# EAGLE design Grove - Temperature&Humidity Sensor(HDC1000) v1.0 (EAGLE 6.4)
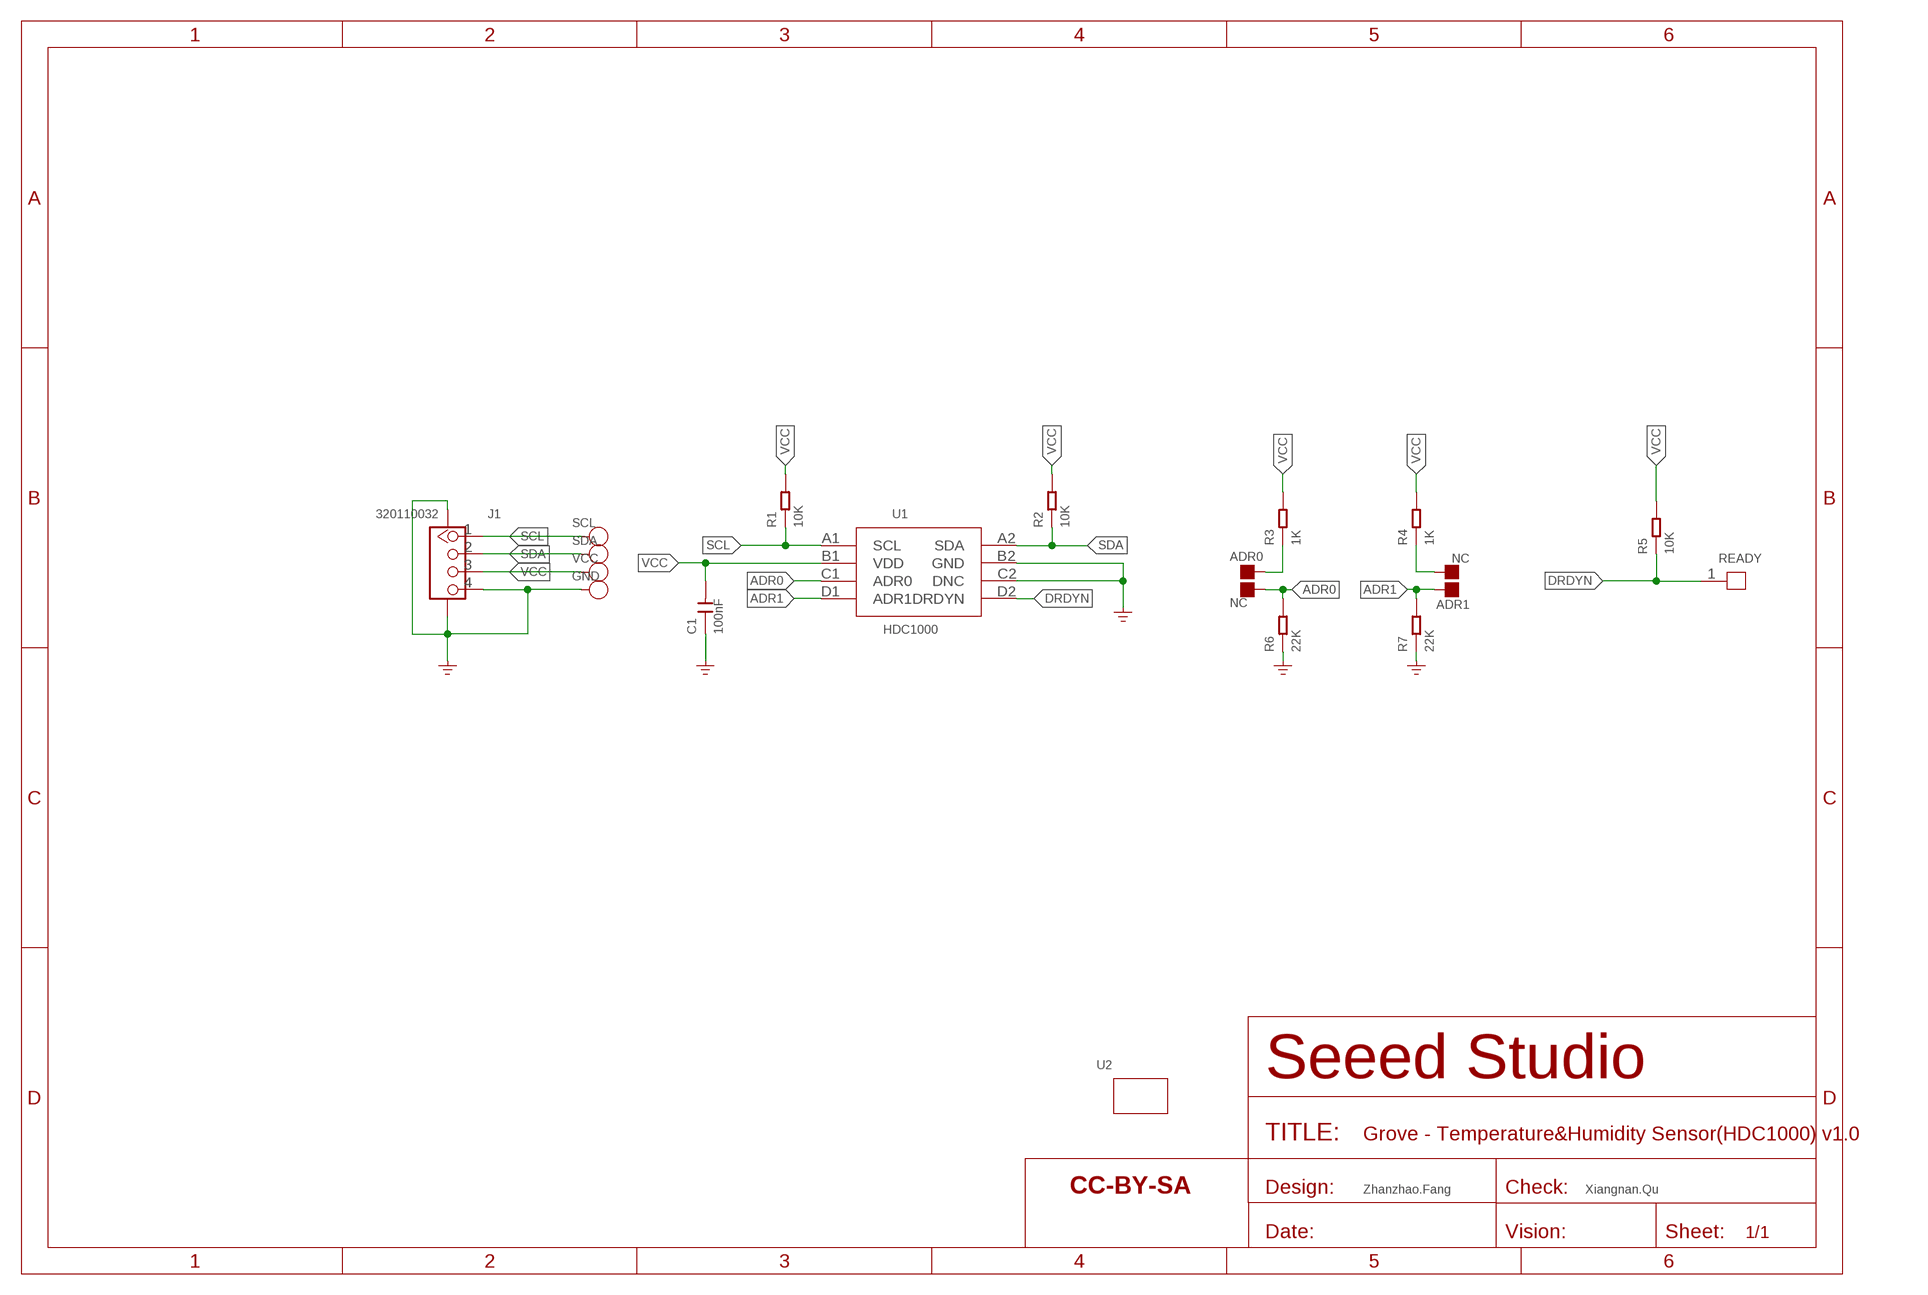
[diagram p0: schematic, sheet 1]

## Parts
ADR0  NC  JUMPER-2P  [JUMPER-2P]
ADR1  NC  JUMPER-2P  [JUMPER-2P]
C1  100nF  CAP-0603  [C0603]
GND  NC  TEST-POINT'4545'  [TP-D45MIL]
J1  320110032  GROVE-CONNECTOR-SMD'90D'  [HW4-SMD-2.0-90D]
R1  10K  RES-0603  [R0603]
R2  10K  RES-0603  [R0603]
R3  1K  RES-0603  [R0603]
R4  1K  RES-0603  [R0603]
R5  10K  RES-0603  [R0603]
R6  22K  RES-0603  [R0603]
R7  22K  RES-0603  [R0603]
READY  HEADER-1P-40  [1P-80/40MIL]
SCL  NC  TEST-POINT'4545'  [TP-D45MIL]
SDA  NC  TEST-POINT'4545'  [TP-D45MIL]
U1  HDC1000  SENSOR-HDC1000  [SNR8-SMD-0.5-2.04X1.59MM]
U2  GROVE'2U'  [GROVE-1*2-TEST-PLATFORM]
U$4  SEEEDSTUDIO-OPEN-SCH-FRAME  [SEEEDSTUDIO-PCB-FRAME]
VCC  NC  TEST-POINT'4545'  [TP-D45MIL]

## Nets
ADR0: ADR0.1 R6.2 U1.C1(ADR0)
ADR1: ADR1.2 R7.2 U1.D1(ADR1)
DRDYN: R5.1 READY.1 U1.D2(DRDYN)
GND: C1.1 GND.T J1.4 J1.SS1 J1.SS2 R6.1 R7.1 U1.B2(GND) U1.C2(DNC) ; supply symbol labelled GND_POWER
N$7: ADR0.2 R3.1
N$8: ADR1.1 R4.1
SCL: J1.1 R1.1 SCL.T U1.A1(SCL)
SDA: J1.2 R2.1 SDA.T U1.A2(SDA)
VCC: C1.2 J1.3 R1.2 R2.2 R3.2 R4.2 R5.2 U1.B1(VDD) VCC.T

## Notes on the sheet
- Zhanzhao.Fang | Xiangnan.Qu

## Library data of the parts
ADR0 ADR1 = Discrete-new:JUMPER-2P; PARTNO: DNP
C1 = Discrete-new:CAP: Ceramic Capacitors
GND SCL SDA VCC = Discrete-new:TEST-POINT; PARTNO: DNP
J1 = Connector-new:GROVE-CONNECTOR-SMD: 4P-SMD-2.0:320110030;4P-SMD-2.0-90D:320110032
R1-R7 = Discrete-new:RES
READY = Connector-new:HEADER-1P
U1 = template:SENSOR-HDC1000
U2 = moudle-new:GROVE
U$4 = moudle-new:SEEEDSTUDIO-OPEN-SCH-FRAME

## Net classes
0 default: width 0.102 mm, drill 0.203 mm, clearance 0.102 mm
3 usbvcc: width 0.203 mm, drill 0.305 mm, clearance 0.203 mm

## Board
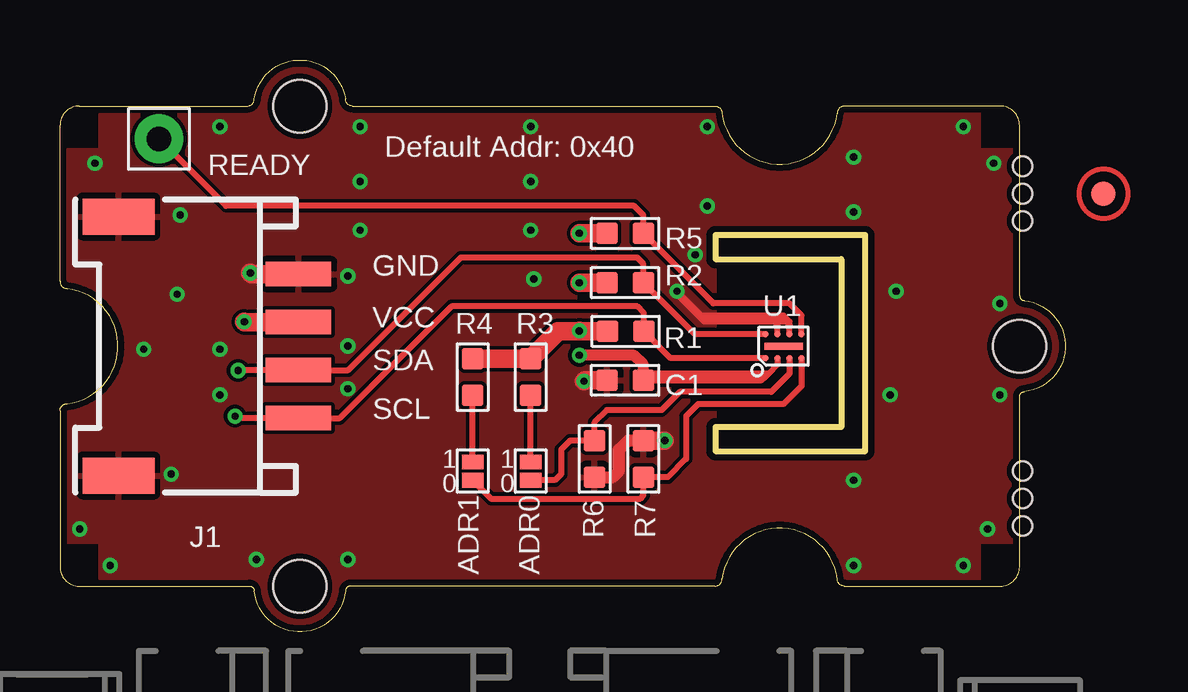
[diagram p1: board, top side]
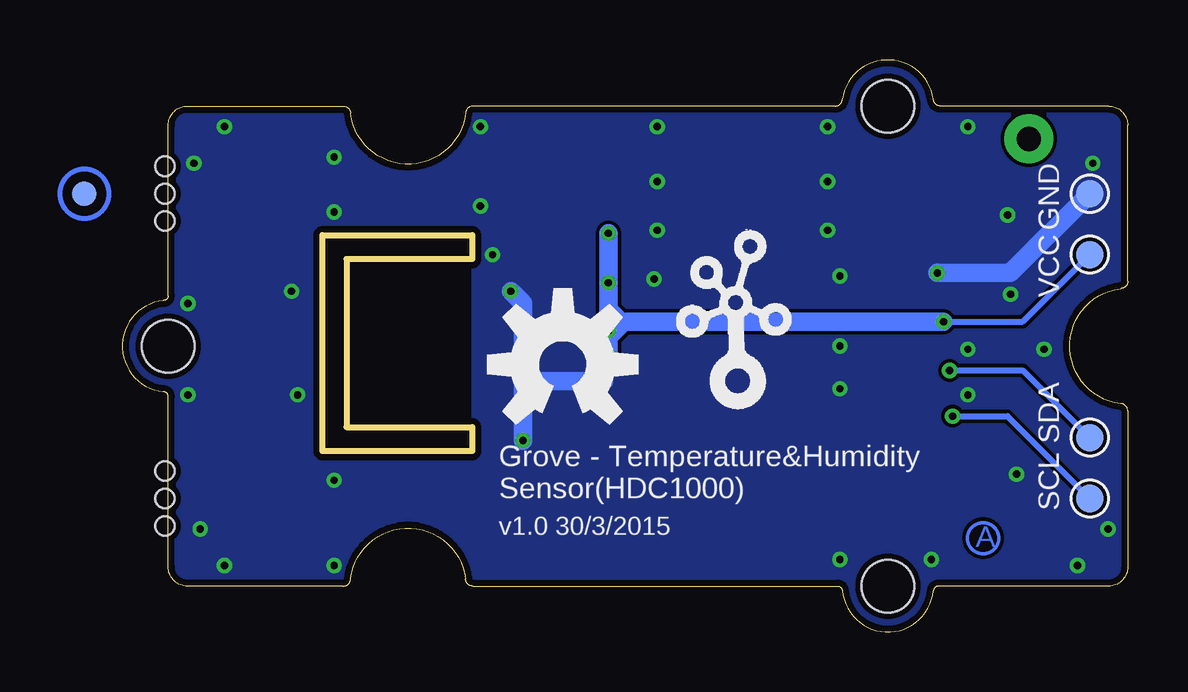
[diagram p2: board, bottom side, seen from below]

Size 41.91 x 23.83 mm. Coordinates in mm from the lower left corner, seen from the top.
Outline: 27.33,15.54 32.57,15.54 32.57,8.54 27.33,8.54 27.33,7.54 33.57,7.54 33.57,16.54 27.33,16.54 27.33,15.54
Copper layers (1*16): Top 0.035mm / dielectric 1.5mm / Bottom 0.035mm
Design rules "SeeedStudio_2layer_DRU_no_angle_20140221 *": minimum track width 6mil, minimum drill 12mil, track to track 6mil, track to pad 6mil, pad to pad 6mil, via to via 6mil, smd to smd 0mil, copper to edge 10mil, drill to drill 10mil, minimum pad ring 10mil, minimum via ring 6mil, stop-mask expansion 2mil, vias tented up to drill 25mil, thermal gap 10mil
Holes 0.8 mm at 40.13,17.12 40.13,19.4 40.13,18.26 40.13,4.42 40.13,6.7 40.13,5.56

### Footprints (pad centres in the part's own frame; a part is rotated, then mirrored left to right if it is on the bottom)
JUMPER-2P = smd 0.889 x 0.61: 1 0,0.381; 2 0,-0.381
C0603 = smd 0.889 x 0.889: 1 0,0.762; 2 0,-0.762
TP-D45MIL = smd 1.143 x 1.143: T 0,0
HW4-SMD-2.0-90D = smd 1.01 x 2.74: 1 -3,-0.1; 2 -1,-0.1; 3 1,-0.1; 4 3,-0.1 | smd 1.5 x 3: SS1 -5.4,7.4; SS2 5.4,7.4
ROUND-MARK-1.0 = smd 1.016 x 1.016: P$1 0,0
R0603 = smd 0.889 x 0.889: 1 0,0.762; 2 0,-0.762
1P-80/40MIL = drill 1.016 pad 2.032: 1 0,0
SNR8-SMD-0.5-2.04X1.59MM = smd 0.263 x 0.263: A1 -0.5,0.75; A2 0.5,0.75; B1 -0.5,0.25; B2 0.5,0.25; C1 -0.5,-0.25; C2 0.5,-0.25; D1 -0.5,-0.75; D2 0.5,-0.75 | smd 0.3 x 1.6: P$1 0,0
GROVE-1*2-TEST-PLATFORM = hole 2.2: -10,-10; -10,10; 20,0
GROVE-TEST-PLATFORM = hole 2.2: -10,-10; -10,10; 20,0

### Placement (x,y rotation side)
ADR0  19.62,6.7 180 top
ADR1  17.21,6.7 0 top
C1  23.56,10.49 90 top
GND  1.59,18.26 0 bottom
J1  9.84,11.91 90 top
P4  [ROUND-MARK-1.0]  43.5,18.26 0 top
P7  [ROUND-MARK-1.0]  43.5,18.26 0 bottom
R1  23.58,12.52 270 top
R2  23.56,14.55 270 top
R3  19.62,10.61 180 top
R4  17.21,10.61 180 top
R5  23.56,16.61 270 top
R6  22.29,7.21 180 top
R7  24.32,7.21 0 top
READY  4.12,20.54 0 top
SCL  1.59,5.56 0 bottom
SDA  1.59,8.1 0 bottom
U1  30.16,11.91 90 top
U2  20,11.91 0 top
U10  [GROVE-TEST-PLATFORM]  20,11.91 0 top
U$4  -39.06,-123.85 0 top  (outside the outline)
U$7  [GROVE-SILK-BIG]  16.32,10.26 0 bottom
U$10  [OSHW_FILLX250_NOTEXT]  23.56,11.15 0 bottom
VCC  1.59,15.72 0 bottom

### Tracks (layer width: path | path; a pad name or v marks a point on that pad's centre or on a via)
ADR0
  Top 0.254: U1.C1 30.41,10.76 29.65,10 25.84,10 25.08,9.24 22.79,9.24 22.29,8.73 R6.2 21.27,7.97 20.89,7.59 20.89,6.57 20.63,6.32 ADR0.1
ADR1
  Top 0.254: U1.D1 30.91,10.25 30.16,9.5 26.6,9.5 26.1,8.99 26.1,7.21 25.33,6.45 R7.2 24.32,5.69 24.19,5.56 17.97,5.56 ADR1.2
DRDYN
  Top 0.254: U1.D2 30.91,13.19 30.41,13.69 27.24,13.69 R5.1 24.32,17.37 23.94,17.75 6.92,17.75 READY.1
GND  (via drill 0.3 pad 0.64)
  Top 0.254: U1.B2 29.91,12.79 29.78,12.92 | 29.78,12.92 26.86,12.92 25.71,14.07 | U1.C2 30.41,12.8 | 30.41,12.8 30.29,12.92 29.78,12.92 | 30.41,12.8 30.41,12.93 30.16,13.18 26.73,13.18 v25.71,14.19
  Top 0.508: R6.1 23.05,6.45 23.3,6.7 23.3,7.59 23.68,7.97 R7.1
  Top 0.762: J1.4 7.98,14.91 v7.94,14.96 | C1.1 21.88,10.49 v21.84,10.45 | R7.1 v25.21,7.97
  Bottom 0.508: 25.33,9.88 25.21,10
  Bottom 0.762: v7.94,14.96 4.89,14.96 GND.T | 25.21,9.88 25.21,10 25.21,10.51 | 25.21,10.51 25.21,11.02 | 25.21,11.02 25.21,13.69 v25.71,14.19 | 24.63,10.45 25.14,10.45 25.21,10.51 | 24.63,10.45 25.21,11.02 | 24.63,10.45 25.21,9.88 | 24.63,10.45 v21.84,10.45 | 25.21,9.88 v25.21,7.97
  other vias: 6.66,21.05 12.51,21.05 12,3.02 8.19,3.02 12,14.83 26.98,21.05 33.08,19.78 37.65,21.05 38.92,19.53 39.18,13.69 39.18,9.88 38.67,4.29 37.65,2.76 33.08,2.76 33.08,6.32 19.62,21.05 26.48,15.72 1.46,19.53 5.01,17.37 4.89,14.07 3.49,11.78 6.66,11.78 0.82,4.29 2.09,2.76 4.63,6.57 6.66,9.88 34.61,9.88 34.86,14.19 33.08,17.5 26.98,17.75 12.51,18.77 19.62,18.77 19.62,16.73 12.51,16.73 19.75,14.7 12,10.13 12,11.91
  pour Top (rank 6): 42.35,24.99 42.35,1.37 42.35,-1.68 -1.72,-1.68 -1.72,24.99
  pour Bottom (rank 6): 42.35,25.62 42.35,2 42.35,-1.05 -1.72,-1.05 -1.72,25.62
N$1
  cutout Top: 27.49,15.59 27.49,8.61 32.57,8.61 32.57,15.59
N$2
  cutout Bottom: 27.49,15.59 27.49,8.61 32.45,8.61 32.57,8.61 32.57,15.59
N$7
  Top 0.254: ADR0.2 R3.1
N$8
  Top 0.254: ADR1.1 R4.1
SCL  (via drill 0.3 pad 0.64)
  Top 0.254: v7.3,8.99 7.38,8.91 J1.1 11.67,8.91 16.32,13.56 24.06,13.56 24.34,13.28 R1.1 25.45,11.41 U1.A1
  Bottom 0.254: v7.3,8.99 5.01,8.99 SCL.T
SDA  (via drill 0.3 pad 0.64)
  Top 0.254: v7.43,10.89 7.44,10.91 J1.2 12.02,10.91 16.7,15.59 24.06,15.59 24.32,15.34 R2.1 26.46,12.41 U1.A2
  Bottom 0.254: v7.43,10.89 4.38,10.89 SDA.T
VCC  (via drill 0.3 pad 0.64)
  Top 0.254: U1.B1 29.91,11.15 29.52,10.77 | C1.2 29.25,10.49 29.4,10.64 | 29.4,10.64 29.52,10.77 | 29.4,10.64 24.45,10.64 | 29.52,10.77 24.45,10.77
  Top 0.457: C1.2 24.32,11.15 23.94,11.53 v21.65,11.53
  Top 0.762: R2.2 v21.65,14.55 | v21.65,12.54 21.68,12.52 R1.2 20.76,12.52 R3.2 R4.2 | v21.65,16.61 R5.2 | J1.3 7.7,12.91 v7.68,12.92
  Bottom 0.254: v7.68,12.92 4.38,12.92 VCC.T
  Bottom 0.762: v21.65,12.54 21.65,13.43 | 21.65,13.43 v21.65,14.55 v21.65,16.61 | v21.65,12.54 v21.65,11.53 | 21.14,12.92 21.52,12.92 arc-90 21.65,12.8 v21.65,12.54 | 21.02,12.92 v7.68,12.92 | 21.02,12.92 21.14,12.92 | 21.14,12.92 21.65,13.43 | 21.02,12.92 21.52,12.42
(copper drawn outside any net)
  shapes: Bottom circle x1

### Text on the board
Bottom: A
tPlace: Default Addr: 0x40 | GND | VCC | SDA | SCL | 1 | 1 | 0 | 0
bPlace: Grove - Temperature&Humidity / Sensor(HDC1000) | v1.0 30/3/2015